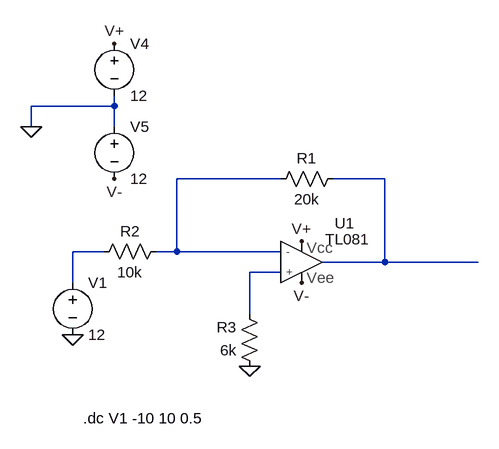
[diagram p0: schematic Inversor.asc]
Inversor.asc, the LTspice schematic file:
Version 4
SHEET 1 880 680
WIRE -96 -96 -96 -112
WIRE -96 -96 -224 -96
WIRE -224 -64 -224 -96
WIRE -96 -64 -96 -96
WIRE 160 16 0 16
WIRE 320 16 240 16
WIRE -112 128 -160 128
WIRE 0 128 0 16
WIRE 0 128 -32 128
WIRE 160 128 0 128
WIRE 320 144 320 16
WIRE 320 144 224 144
WIRE 464 144 320 144
WIRE 160 160 112 160
WIRE -160 176 -160 128
WIRE 112 224 112 160
FLAG 112 304 0
FLAG -160 256 0
FLAG -96 -192 V+
FLAG 192 112 V+
FLAG 192 176 V-
FLAG -96 16 V-
FLAG -224 -64 0
SYMBOL res 256 0 R90
WINDOW 0 0 56 VBottom 2
WINDOW 3 32 56 VTop 2
SYMATTR InstName R1
SYMATTR Value 20k
SYMBOL res -16 112 R90
WINDOW 0 0 56 VBottom 2
WINDOW 3 32 56 VTop 2
SYMATTR InstName R2
SYMATTR Value 10k
SYMBOL res 128 320 R180
WINDOW 0 36 76 Left 2
WINDOW 3 36 40 Left 2
SYMATTR InstName R3
SYMATTR Value 6k
SYMBOL voltage -160 160 R0
WINDOW 123 0 0 Left 0
WINDOW 39 0 0 Left 0
SYMATTR InstName V1
SYMATTR Value 12
SYMBOL voltage -96 -208 R0
WINDOW 123 0 0 Left 0
WINDOW 39 0 0 Left 0
SYMATTR InstName V4
SYMATTR Value 12
SYMBOL Agregados\\TL081 192 144 R0
SYMATTR InstName U1
SYMBOL voltage -96 -80 R0
SYMATTR InstName V5
SYMATTR Value 12
TEXT -144 384 Left 2 !.dc V1 -10 10 0.5

The netlist it stands for:
* Inversor.asc
R1 N002 N001 20k
R2 N001 N003 10k
R3 0 N004 6k
V1 N003 0 12
V4 V+ 0 12
XU1 N004 N001 V+ V- N002 TL081  ; pins + - ? ? ?
V5 0 V- 12
.dc V1 -10 10 0.5
.lib E:\Descargas\TL081.net
.backanno
.end